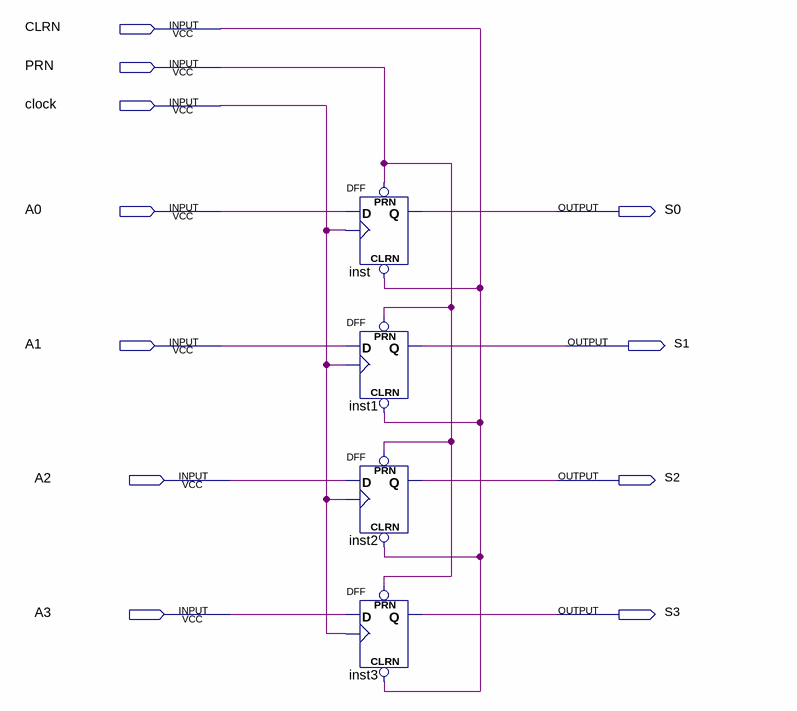
[diagram p0: schematic sheet]
// Quartus schematic Registrador4BitsDeslocamento.bdf as structural Verilog: 4 symbols, 11 pins
module Registrador4BitsDeslocamento (
  input  CLRN,
  input  PRN,
  input  clock,
  input  A0,
  input  A1,
  input  A2,
  input  A3,
  output S0,
  output S1,
  output S2,
  output S3
);

  DFF inst (.CLRN(CLRN), .CLK(clock), .D(A0), .PRN(PRN), .Q(S0));
  DFF inst1 (.CLRN(CLRN), .CLK(clock), .D(A1), .PRN(PRN), .Q(S1));
  DFF inst2 (.CLRN(CLRN), .CLK(clock), .D(A2), .PRN(PRN), .Q(S2));
  DFF inst3 (.CLRN(CLRN), .CLK(clock), .D(A3), .PRN(PRN), .Q(S3));
endmodule
